# EAGLE design ControlBoard_V0.1 (EAGLE 7.7.0)
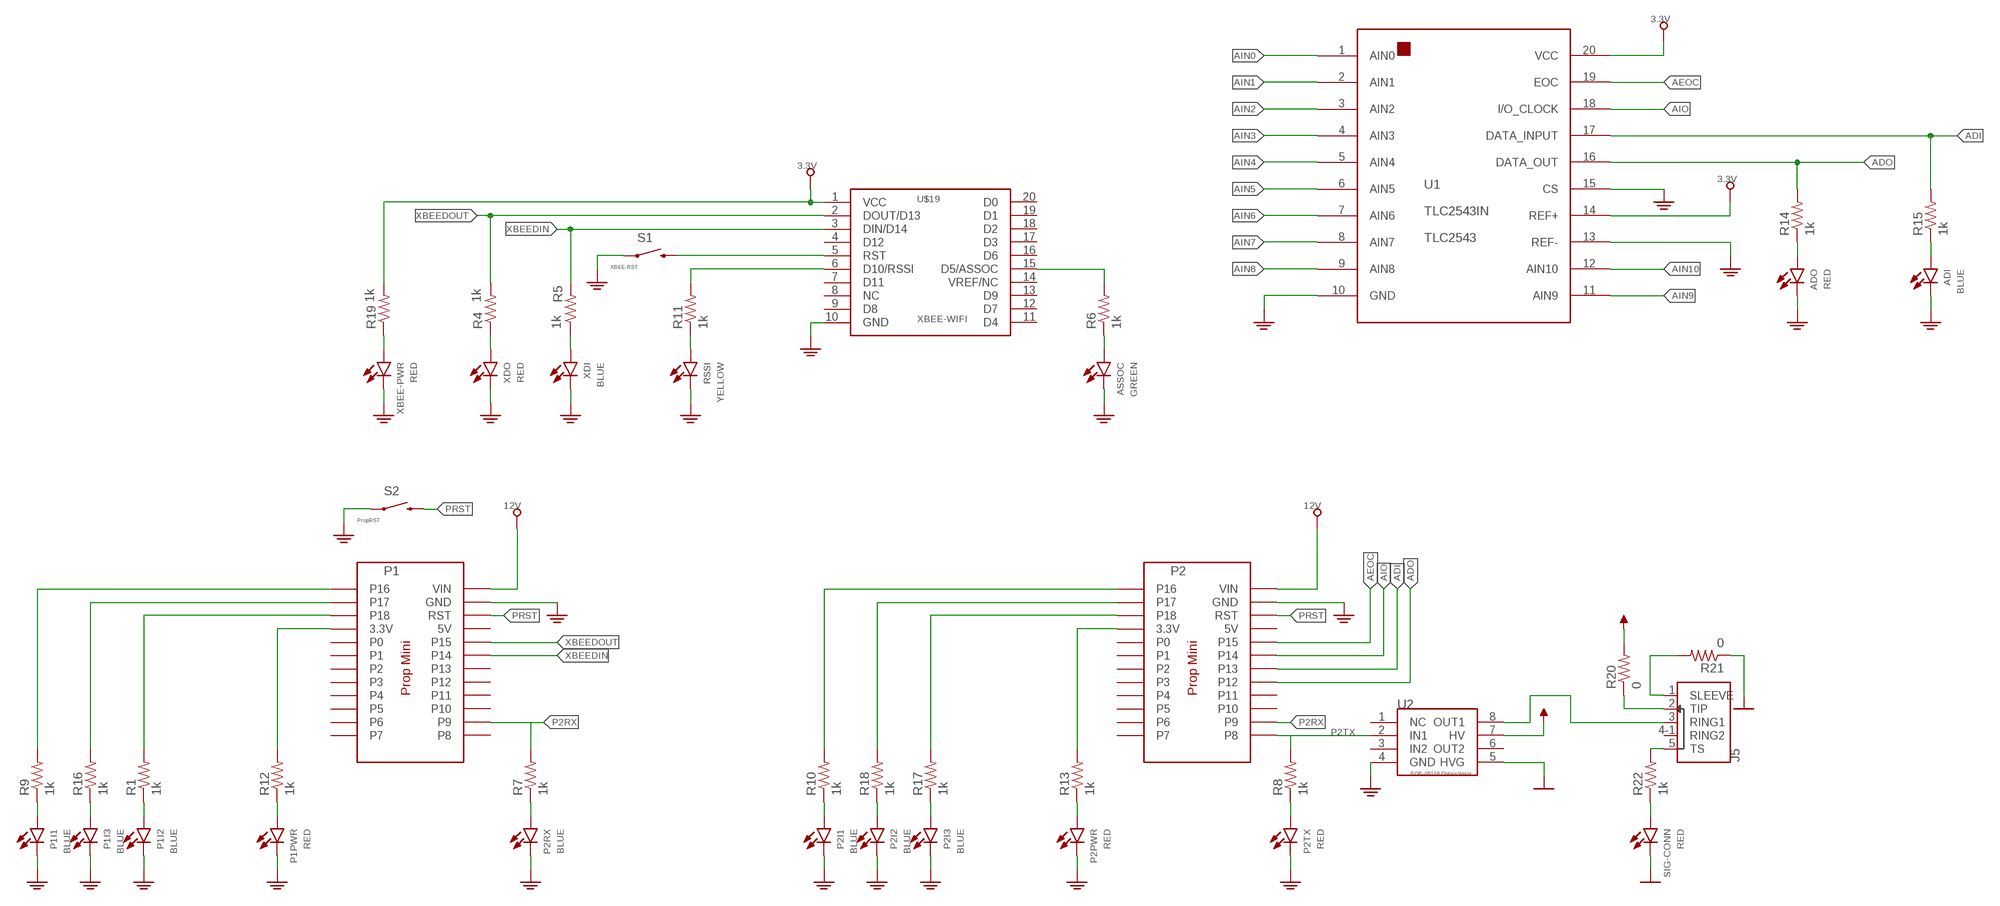
[diagram p0: schematic, sheet 1, part 1 of 2]
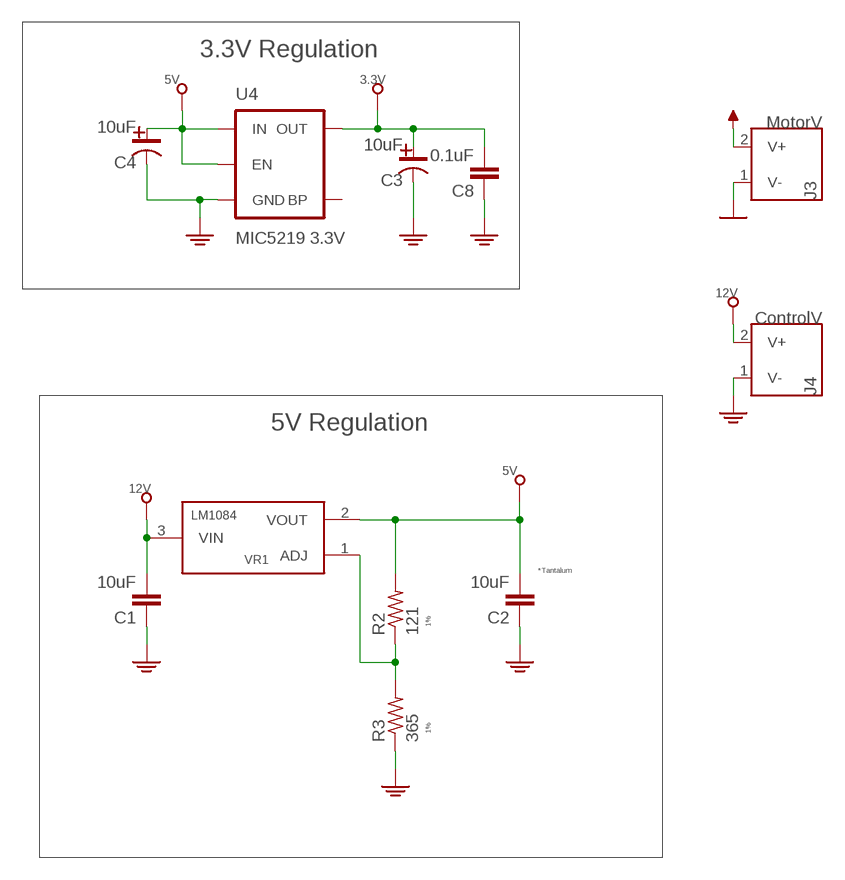
[diagram p1: schematic, sheet 1, part 2 of 2]

## Parts
ADI  BLUE  LED-STD  [0603]
ADO  RED  LED-STD  [0603]
ASSOC  GREEN  LED-STD  [0603]
C1  10uF  C0603  [0603]
C2  10uF  C0603  [0603]
C3  10uF  C-POL-T  [0603-POL]
C4  10uF  C-POL-T  [0603-POL]
C8  0.1uF  C0603  [0603]
J3  MotorV  SINGLE-LINE-TR  [PJ-002BH-SMT]
J4  ControlV  SINGLE-LINEA  [PJ-037A]
J5  SJ1-42535TS  [SJ1-42534-SMT]
P1  PROP-MINI  [PROP-MINI]
P1I1  BLUE  LED-STD  [0603]
P1I2  BLUE  LED-STD  [0603]
P1I3  BLUE  LED-STD  [0603]
P1PWR  RED  LED-STD  [0603]
P2  PROP-MINI  [PROP-MINI]
P2I1  BLUE  LED-STD  [0603]
P2I2  BLUE  LED-STD  [0603]
P2I3  BLUE  LED-STD  [0603]
P2PWR  RED  LED-STD  [0603]
P2RX  BLUE  LED-STD  [0603]
P2TX  RED  LED-STD  [0603]
R1  1k  R0603  [0603]
R2  121  R0603  [0603]
R3  365  R0603  [0603]
R4  1k  R0603  [0603]
R5  1k  R0603  [0603]
R6  1k  R0603  [0603]
R7  1k  R0603  [0603]
R8  1k  R0603  [0603]
R9  1k  R0603  [0603]
R10  1k  R0603  [0603]
R11  1k  R0603  [0603]
R12  1k  R0603  [0603]
R13  1k  R0603  [0603]
R14  1k  R0603  [0603]
R15  1k  R0603  [0603]
R16  1k  R0603  [0603]
R17  1k  R0603  [0603]
R18  1k  R0603  [0603]
R19  1k  R0603  [0603]
R20  0  R0603  [0603]
R21  0  R0603  [0603]
R22  1k  R0603  [0603]
RSSI  YELLOW  LED-STD  [0603]
S1  XBEE-RST  SWITCH-MOMENTARY-2SMD-2  [TACTILE_SWITCH_SMD-2]
S2  PropRST  SWITCH-MOMENTARY-2SMD-2  [TACTILE_SWITCH_SMD-2]
SIG-CONN  RED  LED-STD  [0603]
U1  TLC2543IN  [DIL-20]
U2  BOB-09118  [DIL08-0.1P-6W]
U4  MIC5219 3.3V  V_REG_MIC52193.3V  [SOT23-5]
U$19  XBEE-WIFI  [XBEE-STD]
VR1  LM1084  [TO-220]
XBEE-PWR  RED  LED-STD  [0603]
XDI  BLUE  LED-STD  [0603]
XDO  RED  LED-STD  [0603]

## Nets
3.3V: C3.2 C8.2 R19.2 U1.14(REF+) U1.20(VCC) U4.5(OUT) U$19.1(VCC)
5V: C2.2 C4.2 R2.2 U4.1(IN) U4.3(EN) VR1.2(VOUT)
12V: C1.2 J4.2(V+) P1.VIN P2.VIN VR1.3(VIN)
ADI: P2.P13 R15.2 U1.17(DATA_INPUT)
ADO: P2.P12 R14.2 U1.16(DATA_OUT)
AEOC: P2.P15 U1.19(EOC)
AIN0: U1.1(AIN0)
AIN1: U1.2(AIN1)
AIN2: U1.3(AIN2)
AIN3: U1.4(AIN3)
AIN4: U1.5(AIN4)
AIN5: U1.6(AIN5)
AIN6: U1.7(AIN6)
AIN7: U1.8(AIN7)
AIN8: U1.9(AIN8)
AIN9: U1.11(AIN9)
AIN10: U1.12(AIN10)
AIO: P2.P14 U1.18(I/O_CLOCK)
GND: ADI.OUT ADO.OUT ASSOC.OUT C1.1 C2.1 C3.1 C4.1 C8.1 J4.1(V-) P1.GND P1I1.OUT P1I2.OUT P1I3.OUT P1PWR.OUT P2.GND P2I1.OUT P2I2.OUT P2I3.OUT P2PWR.OUT P2RX.OUT P2TX.OUT R3.1 RSSI.OUT S1.2 S2.2 U1.10(GND) U1.13(REF-) U1.15(CS) U2.4(GND) U4.2(GND) U$19.10(GND) XBEE-PWR.OUT XDI.OUT XDO.OUT
GND2: J3.1(V-) R21.1 SIG-CONN.OUT U2.5(HVG)
N$1: R4.1 XDO.IN
N$2: P1I1.IN R9.1
N$3: P1.P18 R1.2
N$4: ADO.IN R14.1
N$5: R11.1 RSSI.IN
N$6: ADI.IN R15.1
N$7: R5.1 XDI.IN
N$8: J5.3(RING1) U2.8(OUT1)
N$9: R6.2 U$19.15(D5/ASSOC)
N$10: ASSOC.IN R6.1
N$11: P1.3.3V R12.2
N$12: P1I3.IN R16.1
N$13: P2.3.3V R13.2
N$14: P1I2.IN R1.1
N$15: P1PWR.IN R12.1
N$16: R19.1 XBEE-PWR.IN
N$17: J5.1(SLEEVE) R21.2
N$18: P2RX.IN R7.1
N$19: P2I1.IN R10.1
N$20: S1.1 U$19.5(RST)
N$21: R2.1 R3.2 VR1.1(ADJ)
N$22: R11.2 U$19.6(D10/RSSI)
N$23: P1.P16 R9.2
N$24: P2I2.IN R18.1
N$25: R10.2
N$26: P2I3.IN R17.1
N$27: P1.P17 R16.2
N$28: P2PWR.IN R13.1
N$29: R17.2
N$30: P2TX.IN R8.1
N$31: R18.2
N$32: J5.2(TIP) R20.1
N$33: R22.1 SIG-CONN.IN
N$34: J5.5(TS) R22.2
P2RX: P1.P9 P2.P9 R7.2
P2TX: P2.P8 R8.2 U2.2(IN1)
PRST: P1.RST P2.RST S2.1
VCC2: J3.2(V+) R20.2 U2.7(HV)
XBEEDIN: P1.P14 R5.2 U$19.3(DIN/D14)
XBEEDOUT: P1.P15 R4.2 U$19.2(DOUT/D13)
Unconnected: J5.4-1(RING2) P1.5V P1.P0 P1.P1 P1.P2 P1.P3 P1.P4 P1.P5 P1.P6 P1.P7 P1.P8 P1.P10 P1.P11 P1.P12 P1.P13 P2.5V P2.P0 P2.P1 P2.P2 P2.P3 P2.P4 P2.P5 P2.P6 P2.P7 P2.P10 P2.P11 P2.P16 P2.P17 P2.P18 U2.1(NC) U2.3(IN2) U2.6(OUT2) U4.4(BP) U$19.4(D12) U$19.7(D11) U$19.8(NC) U$19.9(D8) U$19.11(D4) U$19.12(D7) U$19.13(D9) U$19.14(VREF/NC) U$19.16(D6) U$19.17(D3) U$19.18(D2) U$19.19(D1) U$19.20(D0)

## Notes on the sheet
- 3.3V Regulation
- 5V Regulation
- *Tantalum
- 1%
- 1%

## Library data of the parts
ADI ADO ASSOC P1I1-P1I3 P1PWR P2I1-P2I3 P2PWR P2RX P2TX RSSI SIG-CONN XBEE-PWR XDI XDO = led:LED-STD
C1 C2 C8 = RCL:C
C3 C4 = RCL:C-POL; CAP-TYPE: TANTALUM
J3 J4 = PWR-Connectors:SINGLE-LINE: 4UCON Part Num: 18742
J5 = audio-connectors:SJ1-42535; MNT: SMT
P1 P2 = Microcontrollers:PROP-MINI
R1-R22 = RCL:R
S1 S2 = SparkFun-Electromechanical:SWITCH-MOMENTARY-2: Various NO switches- pushbuttons, reed, etc; PROD_ID: SWCH-09213
U1 = ADC:TLC2543IN
U2 = Optoisolation:BOB-09118
U4 = SparkFun-PowerIC:V_REG_MIC5219: V_REG MIC5219 Standard 3.3V and 5V 500mA LDO voltage regulator in SOT-23 layout. Micrel part MIC5219. BP (by-pass) pin is used to lower output noise with 470pF cap, may be left open.; PROD_ID: VREG-09872
U$19 = RF:XBEE-WIFI
VR1 = Voltage Regulators:LM1084

## Board
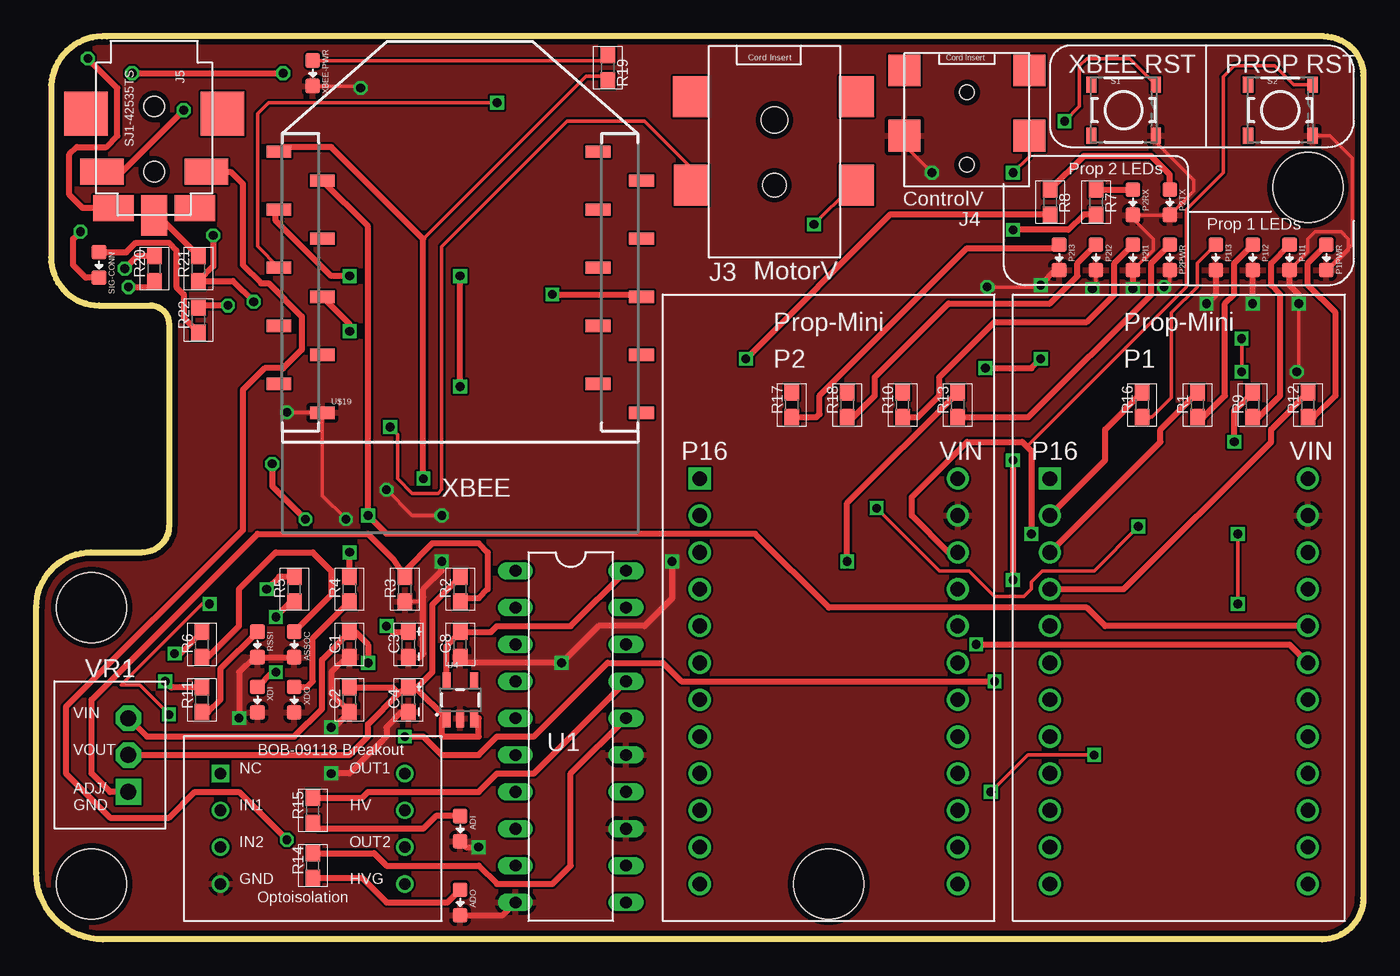
[diagram p2: board, top side]
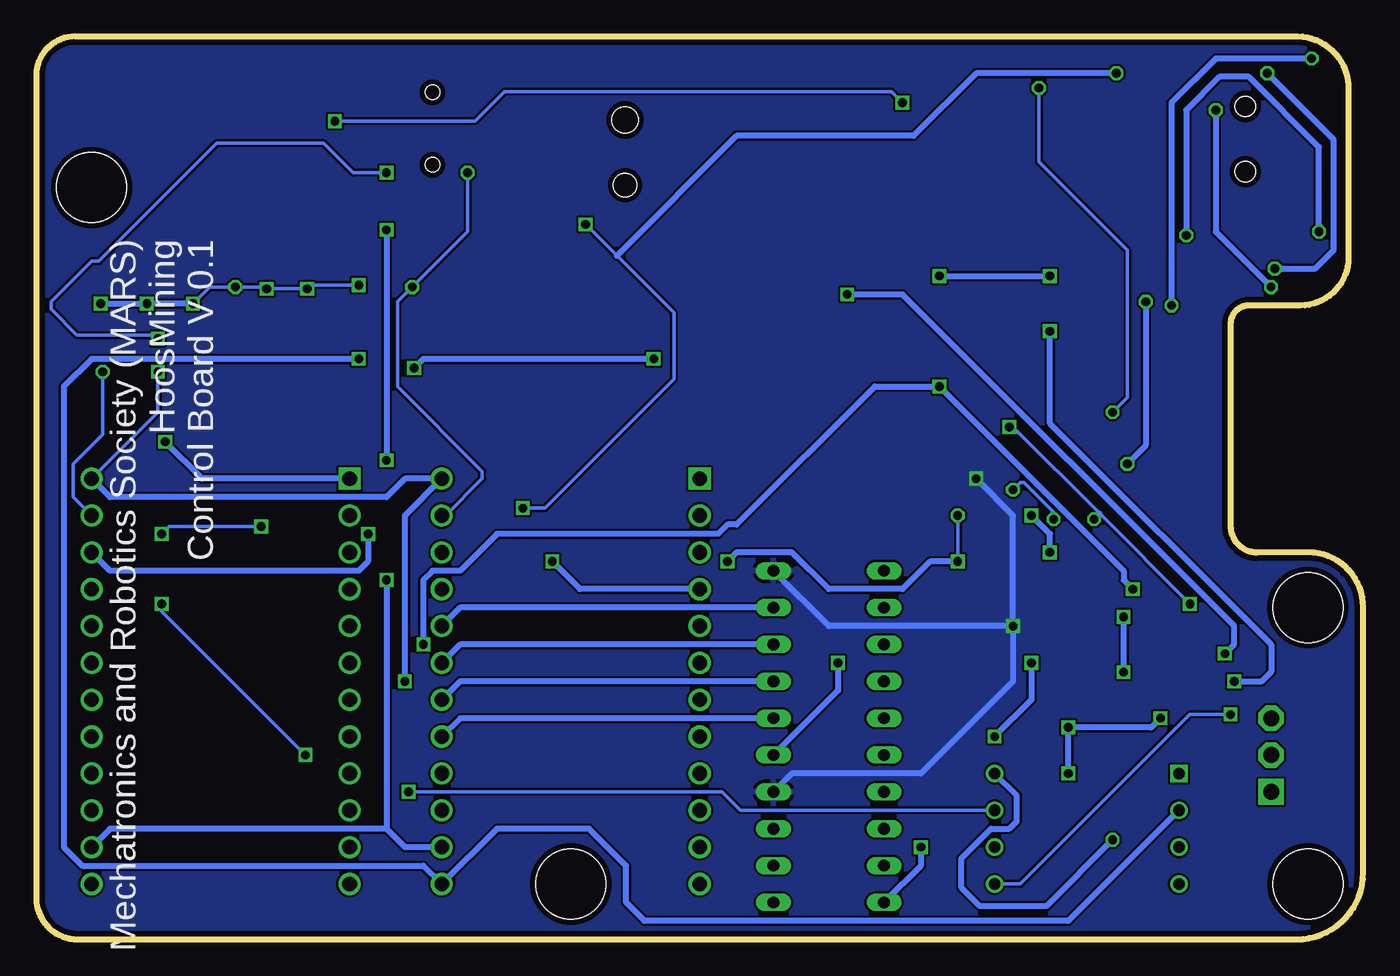
[diagram p3: board, bottom side, seen from below]

Size 91.44 x 62.24 mm. Coordinates in mm from the lower left corner, seen from the top.
Outline: 88.75,62.23 4.86,62.23 arc90 1.02,58.89 1.02,47 arc90 4.33,43.69 7.87,43.69 arc-90 9.14,42.42 9.14,28.5 arc-90 7.31,26.67 3.78,26.67 arc90 0,22.89 0,4.58 arc90 4.58,0 88.6,0 arc90 91.44,2.84 91.44,59.54 arc90 88.75,62.23
Copper layers (1*16): Top 0.0356mm / dielectric 1.5011mm / Bottom 0.0356mm
Design rules "LaenPCBOrder": minimum track width 6mil, minimum drill 13mil, track to track 6mil, track to pad 6mil, pad to pad 6mil, via to via 6mil, smd to smd 6mil, copper to edge 15mil, drill to drill 6mil, minimum pad ring 7mil, minimum via ring 7mil, stop-mask expansion 3mil, vias tented up to drill 0mil, thermal gap 10mil
Holes 4.83 mm at 3.81,3.81 3.81,22.86 87.63,51.82 54.61,3.81

### Footprints (pad centres in the part's own frame; a part is rotated, then mirrored left to right if it is on the bottom)
0603 = smd 1 x 1: IN 0,-0.877; OUT 0,0.877
0603' = smd 1.1 x 1: 1 -0.85,0; 2 0.85,0
0603-POL = smd 1.1 x 1: 1 -0.85,0; 2 0.85,0
PJ-002BH-SMT = smd 2.8 x 2.4: 1 -2,6.305; 1. 4.1,6.35; 2 -2,-5.08; 3 4.1,-5.08 | hole 1.6: -2,0.57 | hole 1.803: 2.5,0.57
PJ-037A = smd 2.2 x 2.2: 1 4.3,0.5; 1. 4.3,-4; 2 -4.3,0.5; 3 -4.3,-4 | hole 1: 0,2.5; 0,-2.5
SJ1-42534-SMT = smd 2.8 x 1.8: 1 7.5,0 | smd 1.8 x 3: 2 4.5,-3.6; 3 4.5,3.6 | smd 3 x 3: 4-1 0.5,4.7; 4-2 0.5,-4.7 | smd 1.8 x 2.8: 5 7,-2.8; 6 7,2.8 | hole 1.4: 0,0; 4.5,0
PROP-MINI = drill 1.016: 3.3V -8.89,6.35; 5V 8.89,6.35; GND 8.89,11.43; P0 -8.89,3.81; P1 -8.89,1.27; P2 -8.89,-1.27; P3 -8.89,-3.81; P4 -8.89,-6.35; P5 -8.89,-8.89; P6 -8.89,-11.43; P7 -8.89,-13.97; P8 8.89,-13.97; P9 8.89,-11.43; P10 8.89,-8.89; P11 8.89,-6.35; P12 8.89,-3.81; P13 8.89,-1.27; P14 8.89,1.27; P15 8.89,3.81; P17 -8.89,11.43; P18 -8.89,8.89; RST 8.89,8.89; VIN 8.89,13.97 | drill 1.016 square: P16 -8.89,13.97
TACTILE_SWITCH_SMD-2 = smd 0.7 x 1.1: 1 2.225,1.75; 2 2.225,-1.75; 3 -2.225,-1.75; 4 -2.225,1.75
DIL-20 = drill 0.813 long: 1 -8.89,6.35; 2 -8.89,3.81; 3 -8.89,1.27; 4 -8.89,-1.27; 5 -8.89,-3.81; 6 -8.89,-6.35; 7 -8.89,-8.89; 8 -8.89,-11.43; 9 -8.89,-13.97; 10 -8.89,-16.51; 11 -1.27,-16.51; 12 -1.27,-13.97; 13 -1.27,-11.43; 14 -1.27,-8.89; 15 -1.27,-6.35; 16 -1.27,-3.81; 17 -1.27,-1.27; 18 -1.27,1.27; 19 -1.27,3.81; 20 -1.27,6.35
DIL08-0.1P-6W = drill 0.8 square: 1 -5.08,5.08 | drill 0.8: 2 -5.08,2.54; 3 -5.08,0; 4 -5.08,-2.54; 5 7.62,-2.54; 6 7.62,0; 7 7.62,2.54; 8 7.62,5.08
SOT23-5 = smd 0.55 x 1.2: 1 -0.95,-1.3; 2 0,-1.3; 3 0.95,-1.3; 4 0.95,1.3; 5 -0.95,1.3
XBEE-STD = smd 1.7 x 0.85: 1 -12.5,8.57; 2 -9.5,6.57; 3 -12.5,4.57; 4 -9.5,2.57; 5 -12.5,0.57; 6 -9.5,-1.43; 7 -12.5,-3.43; 8 -9.5,-5.43; 9 -12.5,-7.43; 10 -9.5,-9.43; 11 12.5,-9.43; 12 9.5,-7.43; 13 12.5,-5.43; 14 9.5,-3.43; 15 12.5,-1.43; 16 9.5,0.57; 17 12.5,2.57; 18 9.5,4.57; 19 12.5,6.57; 20 9.5,8.57
TO-220 = drill 1.1 pad 1.778 square: 1 0,-2.54 | drill 1.1 pad 1.778 octagon: 2 0,0; 3 0,2.54

### Placement (x,y rotation side)
ADI  29.21,7.62 180 top
ADO  29.21,2.54 180 top
ASSOC  17.78,20.32 180 top
C1  10uF  [0603']  21.59,20.32 90 top
C2  10uF  [0603']  21.59,16.51 90 top
C3  25.65,20.32 90 top
C4  25.65,16.51 90 top
C8  0.1uF  [0603']  29.21,20.32 90 top
J3  51.44,53.98 90 top
J4  64.14,55.88 180 top
J5  8.13,57.4 270 top
P1  78.74,17.78 0 top
P1I1  86.36,46.99 180 top
P1I2  83.82,46.99 180 top
P1I3  81.28,46.99 180 top
P1PWR  88.9,46.99 180 top
P2  54.61,17.78 0 top
P2I1  75.56,46.99 180 top
P2I2  73.03,46.99 180 top
P2I3  70.48,46.99 180 top
P2PWR  78.11,46.99 180 top
P2RX  75.56,50.8 180 top
P2TX  78.11,50.8 180 top
R1  1k  [0603']  80.01,36.83 90 top
R2  121  [0603']  29.21,24.13 90 top
R3  365  [0603']  25.4,24.13 90 top
R4  1k  [0603']  21.59,24.13 90 top
R5  1k  [0603']  17.78,24.13 90 top
R6  1k  [0603']  11.43,20.32 90 top
R7  1k  [0603']  73.03,50.8 270 top
R8  1k  [0603']  69.85,50.8 270 top
R9  1k  [0603']  83.82,36.83 90 top
R10  1k  [0603']  59.69,36.83 90 top
R11  1k  [0603']  11.43,16.51 90 top
R12  1k  [0603']  87.63,36.83 90 top
R13  1k  [0603']  63.5,36.83 90 top
R14  1k  [0603']  19.05,5.08 90 top
R15  1k  [0603']  19.05,8.89 90 top
R16  1k  [0603']  76.2,36.83 90 top
R17  1k  [0603']  52.07,36.83 90 top
R18  1k  [0603']  55.88,36.83 90 top
R19  1k  [0603']  39.37,60.07 270 top
R20  0  [0603']  8.13,46.23 90 top
R21  0  [0603']  11.18,46.23 90 top
R22  1k  [0603']  11.18,42.67 90 top
RSSI  15.24,20.32 180 top
S1  74.93,57.15 0 top
S2  85.72,57.15 0 top
SIG-CONN  4.32,46.48 180 top
U1  41.91,19.05 0 top
U2  17.78,6.35 0 top
U4  29.21,16.51 0 top
U$19  29.21,45.72 0 top
VR1  6.35,12.7 0 top
XBEE-PWR  19.05,59.69 180 top
XDI  15.24,16.51 180 top
XDO  17.78,16.51 180 top

### Tracks (layer width: path | path; a pad name or v marks a point on that pad's centre or on a via)
3.3V  (via drill 0.6)
  Top 0.254: R19.2 39.12,59.48 37.88,59.48 26.67,48.26
  Top 0.406: U4.5 28.26,20.22 C8.2 31.33,21.17 31.75,21.59 36.83,21.59 U1.20 | v24.13,21.59 24.55,21.17 C3.2 | v26.67,31.75 26.67,48.26 20.32,54.61 17.03,54.61 U$19.1
  Bottom 0.406: v24.13,21.59 36.83,21.59 U1.20 | v24.13,21.59 24.13,17.78 30.48,11.43 39.37,11.43 U1.14 | v24.13,21.59 24.13,29.21 v26.67,31.75
  pour Bottom: 0,66.04 0,0 91.44,0 91.44,66.04
5V
  Top 0.406: 26.11,17.36 U4.1 27.94,15.21 27.94,13.97 30.48,13.97 30.48,15.24 30.16,15.24 U4.3 | 26.11,17.36 26.25,17.36 27.3,18.41 27.3,23.07 R2.2 | VR1.2 21.59,12.7 22.86,13.97 22.86,14.82 24.98,16.93 | 26.11,17.36 C4.2 25.4,17.36 24.98,16.93 | C2.2 24.55,17.36 24.98,16.93
12V  (via drill 0.6)
  Top 0.254: J4.2 68.44,53.96 v67.31,52.83 | v83.06,41.4 v83.06,39.12
  Top 0.406: VR1.3 7.62,13.97 17.78,13.97 19.68,15.88 19.68,19.27 C1.2 22.01,21.17 22.86,20.32 v22.86,19.05 | v25.4,13.97 26.67,13.97 27.94,12.7 30.48,12.7 31.75,13.97 34.29,13.97 39.37,19.05 43.18,19.05 44.45,17.78 v66.04,17.78
  Bottom 0.254: v67.31,52.83 69.6,52.83 71.63,54.86 78.99,54.86 87.12,46.74 87.63,46.74 90.42,43.94 90.42,43.43 88.65,41.66 83.31,41.66 v83.06,41.4 | v83.06,39.12 83.06,36.32 P1.VIN
  Bottom 0.406: v22.86,19.05 22.86,16.51 v25.4,13.97 | v66.04,17.78 66.04,29.21 P2.VIN 66.04,31.75 67.31,30.48 86.36,30.48 P1.VIN
ADI
  Top 0.406: R15.2 22.44,9.74 22.86,10.16 30.48,10.16 31.75,11.43 34.29,11.43 U1.17
  Bottom 0.406: U1.17 62.23,17.78 P2.P13
ADO
  Top 0.406: R14.2 23.28,5.93 24.13,5.08 30.48,5.08 31.75,3.81 35.56,3.81 36.83,5.08 36.83,11.43 U1.16
  Bottom 0.406: U1.16 62.23,15.24 P2.P12
AEOC
  Bottom 0.406: U1.19 62.23,22.86 P2.P15
AIO
  Bottom 0.406: U1.18 62.23,20.32 P2.P14
GND  (via drill 0.6)
  Top 0.254: v21.34,28.96 19.71,30.58 U$19.10 19.68,36.32 v17.27,36.32 | v24.13,30.99 25.91,29.21 v27.94,29.21 | R3.1 26.33,23.28 26.67,23.62 | v65.53,44.96 69.09,44.96 v69.22,45.09 | P2I1.OUT 76.96,47.51 76.96,48.26 75.56,49.66 P2RX.OUT P2TX.OUT 79.76,51.57 79.76,52.32 77.16,54.92 S1.2 | P2PWR.OUT 78.11,45.34 v77.72,44.96 | S2.2 89.13,55.4 90.68,53.85 90.68,47.89 P1PWR.OUT 89.04,46.11 90.42,47.5 90.42,48.26 89.92,48.77 88.14,48.77 87.63,48.26 87.63,47.38 P1I1.OUT | v87,43.81 87,39.24 v86.87,39.12 | J4.1 59.83,54.72 v61.72,52.83 | XBEE-PWR.OUT 22.21,58.81 v22.35,58.67 | P2I2.OUT 73.03,45.09 v72.77,44.83
  Top 0.406: C1.1 21.38,19.47 20.32,18.41 20.32,16.93 C2.1 20.54,14.61 v20.32,14.61 | v13.97,15.24 13.97,18.41 15,19.44 RSSI.OUT ASSOC.OUT | 26.45,19.47 26.67,19.68 26.67,23.62 26.67,24.13 27.94,25.4 v27.94,26.04 | v43.81,26.04 43.81,23.5 41.91,21.59 38.73,21.59 v36.2,19.05 29.63,19.05 C8.1 | ADI.OUT 29.6,6.35 v30.48,6.35 | ADO.OUT 32.14,1.66 U1.10 | P2I3.OUT 70.24,46.11 v69.22,45.09 | P2I1.OUT v75.56,44.83 | P1I1.OUT 86.36,45.09 87,44.45 v87,43.81 | v83.82,43.81 P1I2.OUT | P1I3.OUT 81.28,44.45 v80.64,43.81 | 25.19,15.66 24.13,14.61 24.13,13.97 21.59,11.43 v20.32,11.43
  Bottom 0.254: v21.34,28.96 21.34,29.46 23.37,31.5 23.62,31.5 v24.13,30.99 | v27.94,29.21 v27.94,26.04 | P2.GND 63.25,29.21 60.71,31.75 60.71,32.26 66.55,38.1 66.55,43.94 v65.53,44.96 61.72,48.77 v61.72,52.83 | v80.64,43.81 79.5,44.96 v77.72,44.96 75.69,44.96 v75.56,44.83 v72.77,44.83 72.52,45.09 v69.22,45.09 | v86.87,39.12 86.87,34.8 88.9,32.77 88.9,30.48 P1.GND | v22.35,58.67 22.35,53.59 16.26,47.5 16.26,37.34 v17.27,36.32
  Bottom 0.406: v13.97,15.24 14.61,14.61 v20.32,14.61 v20.32,11.43 | v27.94,26.04 29.84,26.04 31.75,24.13 36.83,24.13 39.37,26.67 43.18,26.67 v43.81,26.04 | v36.2,19.05 36.2,17.14 U1.15 | v30.48,6.35 30.48,5.08 U1.10 | v87,43.81 v83.82,43.81 v80.64,43.81
  pour Top: 0,26.67 0,0 91.44,0 91.44,66.04 0.25,66.04 0.25,26.67
GND2  (via drill 0.6)
  Top 0.254: J3.1 45.13,53.17 41.91,56.39 36.58,56.39 27.94,47.75 27.94,30.99 27.69,30.73 25.91,30.73 24.89,31.75 24.89,34.8 v24.38,35.31 | v11.94,23.11 11.43,23.11 5.84,17.53 7.11,17.53 v9.14,15.49
  Top 0.406: SIG-CONN.OUT 3.42,45.6 2.54,46.48 2.54,48.26 v3.05,48.77 | v12.19,48.51 12.19,46.39 R21.1 13.55,45.38 v14.99,43.94 | v16.26,32.77 16.26,31.24 v18.54,28.96
  Bottom 0.254: v24.38,35.31 24.13,35.31 18.16,29.34 v11.94,23.11 | v9.14,15.49 11.94,15.49 23.62,3.81 U2.5
  Bottom 0.406: v3.05,48.77 3.05,54.61 7.87,59.44 9.91,59.44 12.19,57.15 v12.19,48.51 | v14.99,43.94 14.99,34.04 v16.26,32.77 | v18.54,28.96 18.16,29.34
N$1
  Top 0.406: XDO.IN 18.66,17.39 19.05,17.78 19.05,20.74 R4.1
N$2
  Top 0.406: R9.1 84.24,35.98 85.72,37.47 85.72,44.45 85.09,45.09 85.09,46.6 P1I1.IN
N$3
  Top 0.406: P1.P18 77.47,34.29 77.47,35.14 R1.2
N$4
  Top 0.406: R14.1 22.44,4.23 24.13,2.54 28.33,2.54 ADO.IN
N$5
  Top 0.406: R11.1 11.85,15.66 12.7,16.51 12.7,18.66 RSSI.IN
N$6
  Top 0.406: ADI.IN 27.55,8.5 26.67,7.62 19.47,7.62 R15.1
N$7  (via drill 0.6)
  Top 0.406: XDI.IN 16.27,18.41 v16.51,18.41 | v16.51,22.23 17.56,23.28 R5.1
  Bottom 0.406: v16.51,18.41 v16.51,22.23
N$8  (via drill 0.6)
  Top 0.406: J5.3 13.39,52.9 14.22,52.07 14.22,46.48 15.49,45.21 16,45.21 18.29,42.93 18.29,40.64 17.02,39.37 15.75,39.37 14.22,37.85 14.22,28.19 2.03,16 2.03,11.43 5.08,8.38 9.14,8.38 10.92,10.16 13.97,10.16 v17.27,6.86
  Bottom 0.406: v17.27,6.86 21.84,2.29 26.42,2.29 27.69,3.56 27.69,5.59 25.65,7.62 24.38,7.62 23.88,8.13 23.88,9.91 U2.8
N$9  (via drill 0.6)
  Top 0.406: v35.56,44.45 41.55,44.45 U$19.15 | R6.2 9.95,19.68 v9.52,19.68
  Bottom 0.406: v35.56,44.45 31.75,44.45 8.89,21.59 8.89,20.32 v9.52,19.68
N$10
  Top 0.406: R6.1 11.85,19.47 13.97,21.59 13.97,24.13 16.51,26.67 19.05,26.67 20.32,25.4 20.32,23.74 ASSOC.IN
N$11
  Top 0.406: P1.3.3V 74.93,24.13 85.09,34.29 85.09,35.14 R12.2
N$12
  Top 0.254: P1I3.IN 80.01,46.6 80.01,44.96 78.23,43.18 78.23,37.34 76.87,35.98 R16.1
  Top 0.406: R16.1 76.62,35.98
N$13  (via drill 0.6)
  Top 0.406: v55.88,26.04 55.88,30.06 R13.2
  Bottom 0.406: P2.3.3V 53.98,24.13 v55.88,26.04
N$14
  Top 0.406: R1.1 80.43,35.98 81.92,37.47 81.92,43.81 82.55,44.45 82.55,46.6 P1I2.IN
N$15
  Top 0.406: R12.1 88.05,35.98 89.53,37.47 89.53,43.18 87.63,45.09 87.63,46.6 P1PWR.IN
N$16
  Top 0.254: XBEE-PWR.IN 39.02,60.57 R19.1
N$17
  Top 0.406: J5.1 8.35,49.9 R21.2
N$18
  Top 0.406: R7.1 75.54,51.65 P2RX.IN
N$19
  Top 0.406: R10.1 60.75,35.98 62.23,37.47 62.23,38.73 66.04,42.55 72.39,42.55 74.3,44.45 74.3,46.6 P2I1.IN
N$20  (via drill 0.6)
  Top 0.254: U$19.5 15.24,47.76 15.24,56.9 16,57.66 v31.75,57.66 | v70.87,56.39 71.88,57.4 71.88,60.2 72.39,60.71 75.35,60.71 S1.1
  Bottom 0.254: v31.75,57.66 32.51,58.42 59.18,58.42 61.21,56.39 v70.87,56.39
N$21
  Top 0.406: VR1.1 5.08,10.16 3.81,11.43 3.81,16.51 15.24,27.94 22.86,27.94 24.55,26.25 R3.2 25.4,25.4 27.3,27.3 30.48,27.3 31.12,26.67 31.12,24.13 30.48,23.5 29.42,23.5 R2.1
N$22  (via drill 0.6)
  Top 0.406: R11.2 9.31,17.36 v8.89,17.78 | v21.59,41.91 21.59,42.41 U$19.6
  Bottom 0.406: v8.89,17.78 6.98,17.78 6.35,18.41 6.35,20.32 21.59,35.56 v21.59,41.91
N$23  (via drill 0.6)
  Top 0.406: v82.55,34.29 82.55,36.41 R9.2
  Bottom 0.406: P1.P16 80.01,31.75 v82.55,34.29
N$24
  Top 0.406: R18.1 56.3,35.98 57.78,37.47 57.78,38.73 62.86,43.81 69.85,43.81 71.75,45.72 71.75,46.6 P2I2.IN
N$26
  Top 0.406: R17.1 53.76,35.98 53.98,36.2 53.98,37.47 64.14,47.62 70.24,47.62 P2I3.IN
N$27
  Top 0.406: P1.P17 73.66,33.02 73.66,35.14 R16.2
N$28
  Top 0.406: R13.1 68.36,35.98 76.83,44.45 76.83,46.6 P2PWR.IN
N$30
  Top 0.406: P2TX.IN 78.11,52.7 76.83,53.98 72.17,53.98 R8.1
N$32  (via drill 0.6)
  Top 0.406: J5.2 5.91,52.9 v10.16,57.15 | v6.35,44.96 7.71,44.96 R20.1
  Bottom 0.406: v10.16,57.15 10.16,48.77 v6.35,44.96
N$33
  Top 0.406: SIG-CONN.IN 6.21,47.36 6.86,48.01 9.14,48.01 9.65,47.5 9.65,44.96 10.16,44.45 10.16,42.84 R22.1
N$34  (via drill 0.6)
  Top 0.406: J5.5 3.19,50.4 2.29,51.31 2.29,54.1 2.79,54.61 4.83,54.61 5.59,55.37 5.59,58.67 v3.56,60.71 | v13.21,43.69 11.34,43.69 R22.2
  Bottom 0.406: v3.56,60.71 10.16,60.71 13.21,57.66 v13.21,43.69
P2RX  (via drill 0.6)
  Top 0.406: R7.2 72.17,49.95 71.12,48.9 v67.31,48.9 | v67.31,33.02 v67.31,24.77
  Bottom 0.406: P2.P9 66.04,6.35 67.31,7.62 | 67.31,7.62 86.36,7.62 P1.P9 | v67.31,48.9 v67.31,33.02 | v67.31,24.77 67.31,7.62
P2TX  (via drill 0.6)
  Top 0.406: R8.2 58.84,49.95 v48.89,40.01 | v65.41,39.37 68.58,39.37 v69.22,40.01
  Bottom 0.406: U2.2 20.32,1.27 49.53,1.27 50.8,2.54 50.8,5.08 53.34,7.62 59.69,7.62 P2.P8 64.77,5.08 88.27,5.08 89.53,6.35 89.53,38.1 87.63,40.01 v69.22,40.01 | v48.89,40.01 64.77,40.01 v65.41,39.37
PRST  (via drill 0.6)
  Top 0.254: S2.1 86.64,58.9 85.34,60.2 82.55,60.2 81.79,59.44 81.79,52.83 79.25,50.29 79.25,44.96 68.26,33.97
  Top 0.406: P2.RST 62.86,26.67 60.33,29.21 60.33,30.48 64.14,34.29 67.94,34.29 68.26,33.97 68.58,33.66 v68.58,27.94
  Bottom 0.406: P1.RST 86.36,25.4 69.22,25.4 68.58,26.04 v68.58,27.94
VCC2  (via drill 0.6)
  Top 0.254: v65.79,10.16 68.33,12.7 v72.9,12.7 | v82.8,23.11 v82.8,27.94 | v75.95,28.45 72.9,25.4 69.34,25.4 68.58,24.64 68.58,24.13 68.07,23.62 66.04,23.62 64.26,25.4 62.23,25.4 v57.91,29.72 | v53.59,49.28 56.13,51.82 56.36,51.82 J3.2
  Top 0.406: R20.2 6.95,47.08 v6.1,46.23 | v6.6,59.69 v17.02,59.69
  Bottom 0.254: U2.7 42.93,8.89 44.2,10.16 v65.79,10.16 | v72.9,12.7 82.8,22.61 v82.8,23.11 | v82.8,27.94 82.3,28.45 v75.95,28.45 | v57.91,29.72 56.39,29.72 47.5,38.61 47.5,43.18 51.44,47.12 v53.59,49.28
  Bottom 0.406: v6.1,46.23 3.3,46.23 2.03,47.5 2.03,55.12 v6.6,59.69 | v17.02,59.69 26.67,59.69 30.99,55.37 43.18,55.37 51.44,47.12
XBEEDIN  (via drill 0.6)
  Top 0.406: v29.21,38.1 v29.21,45.72 | v21.59,45.72 20.32,45.72 16.51,49.53 16.51,50.09 U$19.3 | v64.77,20.32 86.36,20.32 P1.P14 | R5.2 16.72,24.98 v15.88,24.13
  Bottom 0.406: v29.21,45.72 v21.59,45.72 | v64.77,20.32 64.77,24.77 64.14,25.4 62.23,25.4 59.69,27.94 44.45,27.94 43.81,28.57 43.18,28.57 33.66,38.1 v29.21,38.1 16.51,25.4 16.51,24.77 v15.88,24.13
XBEEDOUT  (via drill 0.6)
  Top 0.406: R4.2 v21.59,26.67 | U$19.2 22.86,49.14 v22.86,29.21 24.13,27.94 49.53,27.94 54.61,22.86 72.39,22.86 73.66,21.59 P1.P15
  Bottom 0.406: v21.59,26.67 21.59,27.94 v22.86,29.21

### Text on the board
tPlace: XBEE RST | PROP RST | Prop 2 LEDs | Prop 1 LEDs | VR1
bPlace: Mechatronics and Robotics Society (MARS) / HoosMining / Control Board V 0.1